# Altium schematic sheet ts2068BoardTop.SchDoc
size A; SheetNumber: 1; SheetTotal: 5
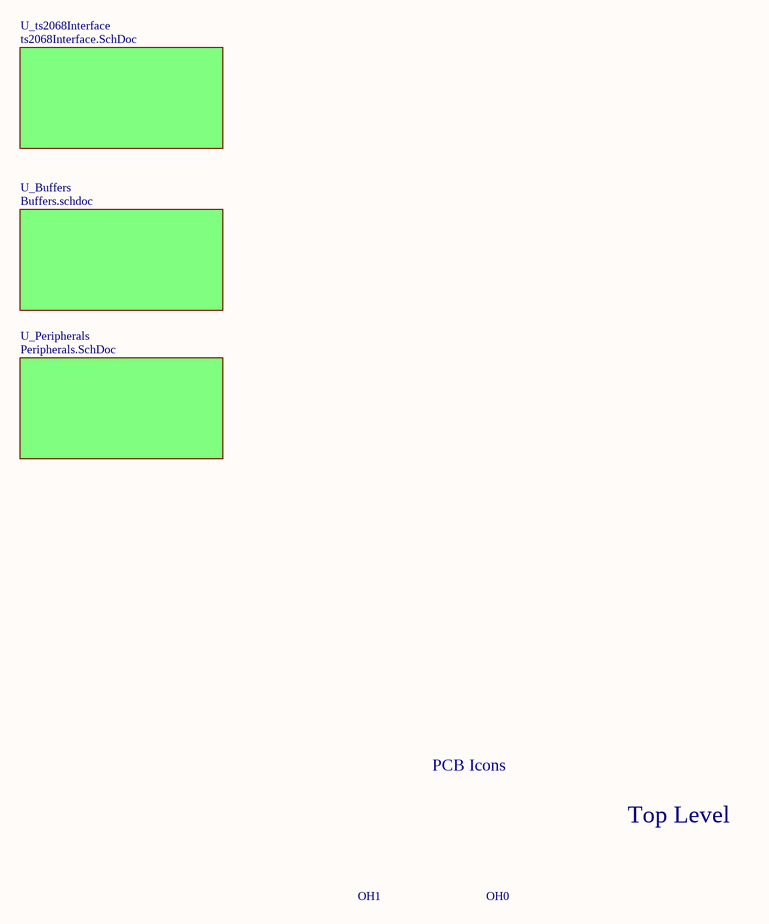
[diagram p0: ts2068BoardTop.SchDoc]

## Parts
OH0  OPENHW_PCB  [OpenHW]  (value not drawn)
OH1  OPENHW_SCH  (value not drawn)

## Sub-sheets
U_Buffers = Buffers.schdoc: no entries
U_Peripherals = Peripherals.SchDoc: no entries
U_ts2068Interface = ts2068Interface.SchDoc: no entries

## Notes on the sheet
- PCB Icons
- Top Level